# EAGLE schematic registerA (EAGLE 9.6.2)
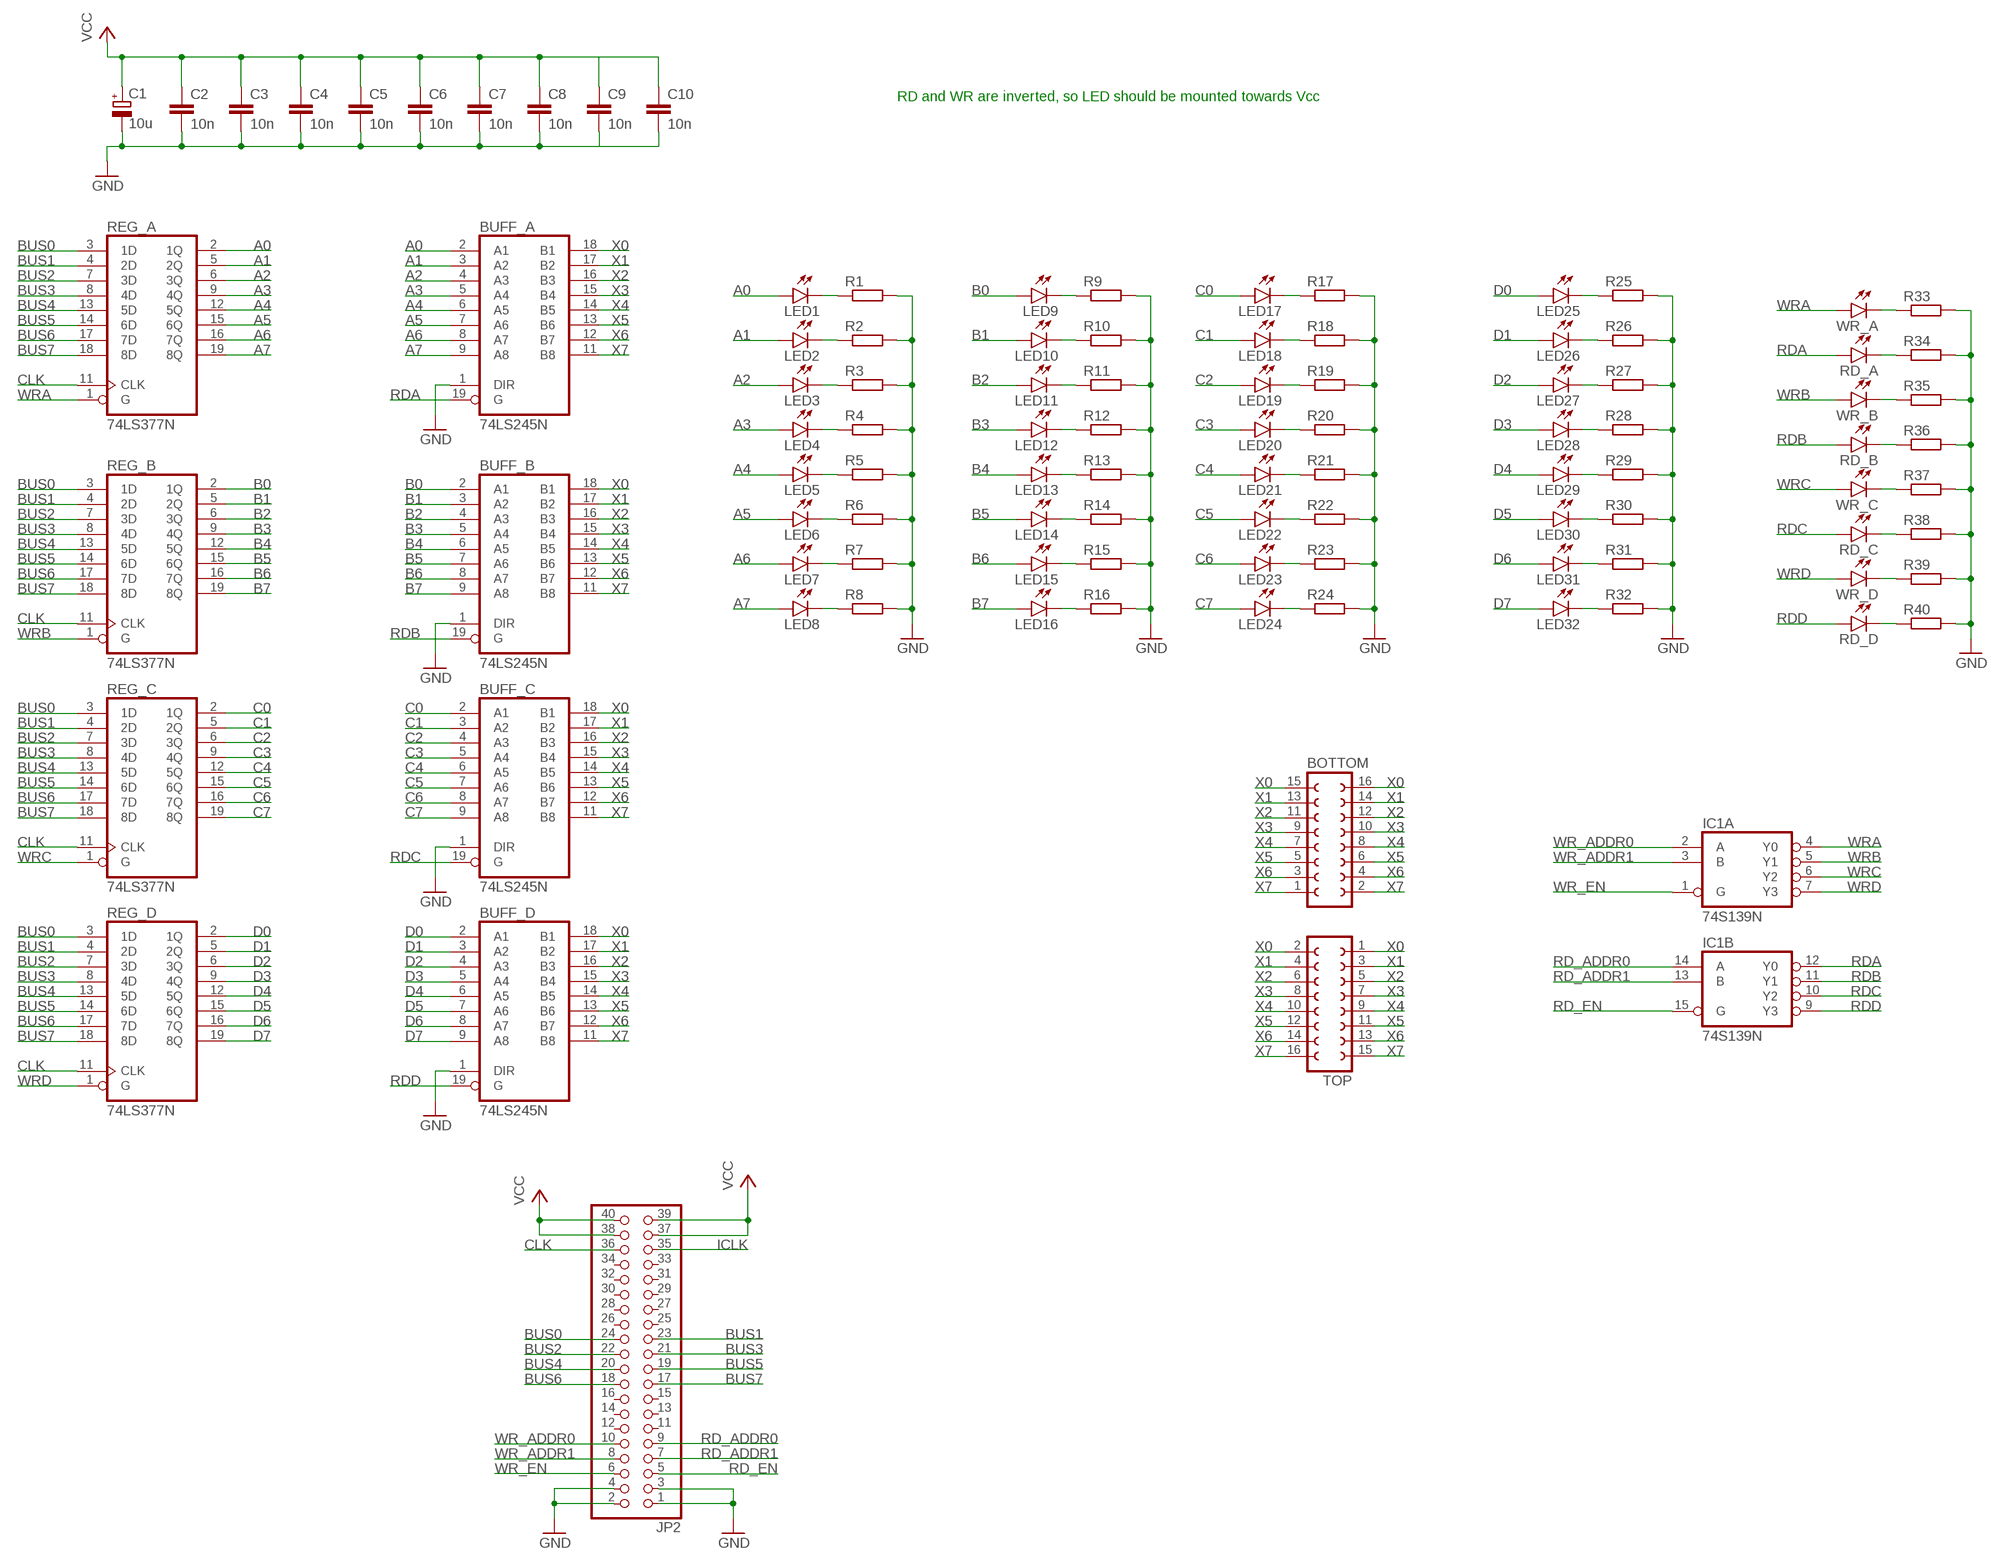
[diagram p0: schematic, sheet 1]

## Parts
BOTTOM  FE08-2W  [FE08-2W]
BUFF_A  74LS245N  [DIL20]
BUFF_B  74LS245N  [DIL20]
BUFF_C  74LS245N  [DIL20]
BUFF_D  74LS245N  [DIL20]
C1  10u  CPOL-EUE5-8.5  [E5-8,5]
C2  10n  C-EU025-024X044  [C025-024X044]
C3  10n  C-EU025-024X044  [C025-024X044]
C4  10n  C-EU025-024X044  [C025-024X044]
C5  10n  C-EU025-024X044  [C025-024X044]
C6  10n  C-EU025-024X044  [C025-024X044]
C7  10n  C-EU025-024X044  [C025-024X044]
C8  10n  C-EU025-024X044  [C025-024X044]
C9  10n  C-EU025-024X044  [C025-024X044]
C10  10n  C-EU025-024X044  [C025-024X044]
IC1  74S139N  [DIL16]
JP2  PINHD-2X20/90  [2X20/90]
LED1  LEDSML1206  [SML1206]
LED2  LEDSML1206  [SML1206]
LED3  LEDSML1206  [SML1206]
LED4  LEDSML1206  [SML1206]
LED5  LEDSML1206  [SML1206]
LED6  LEDSML1206  [SML1206]
LED7  LEDSML1206  [SML1206]
LED8  LEDSML1206  [SML1206]
LED9  LEDSML1206  [SML1206]
LED10  LEDSML1206  [SML1206]
LED11  LEDSML1206  [SML1206]
LED12  LEDSML1206  [SML1206]
LED13  LEDSML1206  [SML1206]
LED14  LEDSML1206  [SML1206]
LED15  LEDSML1206  [SML1206]
LED16  LEDSML1206  [SML1206]
LED17  LEDSML1206  [SML1206]
LED18  LEDSML1206  [SML1206]
LED19  LEDSML1206  [SML1206]
LED20  LEDSML1206  [SML1206]
LED21  LEDSML1206  [SML1206]
LED22  LEDSML1206  [SML1206]
LED23  LEDSML1206  [SML1206]
LED24  LEDSML1206  [SML1206]
LED25  LEDSML1206  [SML1206]
LED26  LEDSML1206  [SML1206]
LED27  LEDSML1206  [SML1206]
LED28  LEDSML1206  [SML1206]
LED29  LEDSML1206  [SML1206]
LED30  LEDSML1206  [SML1206]
LED31  LEDSML1206  [SML1206]
LED32  LEDSML1206  [SML1206]
R1  R-EU_R0805  [R0805]
R2  R-EU_R0805  [R0805]
R3  R-EU_R0805  [R0805]
R4  R-EU_R0805  [R0805]
R5  R-EU_R0805  [R0805]
R6  R-EU_R0805  [R0805]
R7  R-EU_R0805  [R0805]
R8  R-EU_R0805  [R0805]
R9  R-EU_R0805  [R0805]
R10  R-EU_R0805  [R0805]
R11  R-EU_R0805  [R0805]
R12  R-EU_R0805  [R0805]
R13  R-EU_R0805  [R0805]
R14  R-EU_R0805  [R0805]
R15  R-EU_R0805  [R0805]
R16  R-EU_R0805  [R0805]
R17  R-EU_R0805  [R0805]
R18  R-EU_R0805  [R0805]
R19  R-EU_R0805  [R0805]
R20  R-EU_R0805  [R0805]
R21  R-EU_R0805  [R0805]
R22  R-EU_R0805  [R0805]
R23  R-EU_R0805  [R0805]
R24  R-EU_R0805  [R0805]
R25  R-EU_R0805  [R0805]
R26  R-EU_R0805  [R0805]
R27  R-EU_R0805  [R0805]
R28  R-EU_R0805  [R0805]
R29  R-EU_R0805  [R0805]
R30  R-EU_R0805  [R0805]
R31  R-EU_R0805  [R0805]
R32  R-EU_R0805  [R0805]
R33  R-EU_R0805  [R0805]
R34  R-EU_R0805  [R0805]
R35  R-EU_R0805  [R0805]
R36  R-EU_R0805  [R0805]
R37  R-EU_R0805  [R0805]
R38  R-EU_R0805  [R0805]
R39  R-EU_R0805  [R0805]
R40  R-EU_R0805  [R0805]
RD_A  LEDSML1206  [SML1206]
RD_B  LEDSML1206  [SML1206]
RD_C  LEDSML1206  [SML1206]
RD_D  LEDSML1206  [SML1206]
REG_A  74LS377N  [DIL20]
REG_B  74LS377N  [DIL20]
REG_C  74LS377N  [DIL20]
REG_D  74LS377N  [DIL20]
TOP  FE08-2W  [FE08-2W]
WR_A  LEDSML1206  [SML1206]
WR_B  LEDSML1206  [SML1206]
WR_C  LEDSML1206  [SML1206]
WR_D  LEDSML1206  [SML1206]

## Nets
A0: BUFF_A.2(A1) LED1.A REG_A.2(1Q)
A1: BUFF_A.3(A2) LED2.A REG_A.5(2Q)
A2: BUFF_A.4(A3) LED3.A REG_A.6(3Q)
A3: BUFF_A.5(A4) LED4.A REG_A.9(4Q)
A4: BUFF_A.6(A5) LED5.A REG_A.12(5Q)
A5: BUFF_A.7(A6) LED6.A REG_A.15(6Q)
A6: BUFF_A.8(A7) LED7.A REG_A.16(7Q)
A7: BUFF_A.9(A8) LED8.A REG_A.19(8Q)
B0: BUFF_B.2(A1) LED9.A REG_B.2(1Q)
B1: BUFF_B.3(A2) LED10.A REG_B.5(2Q)
B2: BUFF_B.4(A3) LED11.A REG_B.6(3Q)
B3: BUFF_B.5(A4) LED12.A REG_B.9(4Q)
B4: BUFF_B.6(A5) LED13.A REG_B.12(5Q)
B5: BUFF_B.7(A6) LED14.A REG_B.15(6Q)
B6: BUFF_B.8(A7) LED15.A REG_B.16(7Q)
B7: BUFF_B.9(A8) LED16.A REG_B.19(8Q)
BUS0: JP2.24 REG_A.3(1D) REG_B.3(1D) REG_C.3(1D) REG_D.3(1D)
BUS1: JP2.23 REG_A.4(2D) REG_B.4(2D) REG_C.4(2D) REG_D.4(2D)
BUS2: JP2.22 REG_A.7(3D) REG_B.7(3D) REG_C.7(3D) REG_D.7(3D)
BUS3: JP2.21 REG_A.8(4D) REG_B.8(4D) REG_C.8(4D) REG_D.8(4D)
BUS4: JP2.20 REG_A.13(5D) REG_B.13(5D) REG_C.13(5D) REG_D.13(5D)
BUS5: JP2.19 REG_A.14(6D) REG_B.14(6D) REG_C.14(6D) REG_D.14(6D)
BUS6: JP2.18 REG_A.17(7D) REG_B.17(7D) REG_C.17(7D) REG_D.17(7D)
BUS7: JP2.17 REG_A.18(8D) REG_B.18(8D) REG_C.18(8D) REG_D.18(8D)
C0: BUFF_C.2(A1) LED17.A REG_C.2(1Q)
C1: BUFF_C.3(A2) LED18.A REG_C.5(2Q)
C2: BUFF_C.4(A3) LED19.A REG_C.6(3Q)
C3: BUFF_C.5(A4) LED20.A REG_C.9(4Q)
C4: BUFF_C.6(A5) LED21.A REG_C.12(5Q)
C5: BUFF_C.7(A6) LED22.A REG_C.15(6Q)
C6: BUFF_C.8(A7) LED23.A REG_C.16(7Q)
C7: BUFF_C.9(A8) LED24.A REG_C.19(8Q)
CLK: JP2.36 REG_A.11(CLK) REG_B.11(CLK) REG_C.11(CLK) REG_D.11(CLK)
D0: BUFF_D.2(A1) LED25.A REG_D.2(1Q)
D1: BUFF_D.3(A2) LED26.A REG_D.5(2Q)
D2: BUFF_D.4(A3) LED27.A REG_D.6(3Q)
D3: BUFF_D.5(A4) LED28.A REG_D.9(4Q)
D4: BUFF_D.6(A5) LED29.A REG_D.12(5Q)
D5: BUFF_D.7(A6) LED30.A REG_D.15(6Q)
D6: BUFF_D.8(A7) LED31.A REG_D.16(7Q)
D7: BUFF_D.9(A8) LED32.A REG_D.19(8Q)
GND: BUFF_A.1(DIR) BUFF_B.1(DIR) BUFF_C.1(DIR) BUFF_D.1(DIR) C1.- C2.2 C3.2 C4.2 C5.2 C6.2 C7.2 C8.2 C9.2 JP2.1 JP2.2 JP2.3 JP2.4 R1.2 R2.2 R3.2 R4.2 R5.2 R6.2 R7.2 R8.2 R9.2 R10.2 R11.2 R12.2 R13.2 R14.2 R15.2 R16.2 R17.2 R18.2 R19.2 R20.2 R21.2 R22.2 R23.2 R24.2 R25.2 R26.2 R27.2 R28.2 R29.2 R30.2 R31.2 R32.2 R33.2 R34.2 R35.2 R36.2 R37.2 R38.2 R39.2 R40.2
GND1: C10.2
ICLK: JP2.35
N$1: LED1.C R1.1
N$2: LED2.C R2.1
N$3: LED3.C R3.1
N$4: LED4.C R4.1
N$5: LED5.C R5.1
N$6: LED6.C R6.1
N$7: LED7.C R7.1
N$8: LED8.C R8.1
N$10: LED9.C R9.1
N$11: LED10.C R10.1
N$12: LED11.C R11.1
N$13: LED12.C R12.1
N$14: LED13.C R13.1
N$15: LED14.C R14.1
N$16: LED15.C R15.1
N$17: LED16.C R16.1
N$19: LED17.C R17.1
N$20: LED18.C R18.1
N$21: LED19.C R19.1
N$22: LED20.C R20.1
N$23: LED21.C R21.1
N$24: LED22.C R22.1
N$25: LED23.C R23.1
N$26: LED24.C R24.1
N$28: LED25.C R25.1
N$29: LED26.C R26.1
N$30: LED27.C R27.1
N$31: LED28.C R28.1
N$32: LED29.C R29.1
N$33: LED30.C R30.1
N$34: LED31.C R31.1
N$35: LED32.C R32.1
N$37: R33.1 WR_A.C
N$38: R34.1 RD_A.C
N$39: R35.1 WR_B.C
N$40: R36.1 RD_B.C
N$41: R37.1 WR_C.C
N$42: R38.1 RD_C.C
N$43: R39.1 WR_D.C
N$44: R40.1 RD_D.C
RD_ADDR0: IC1.14(B:A) JP2.9
RD_ADDR1: IC1.13(B:B) JP2.7
RD_EN: IC1.15(B:G) JP2.5
RDA: BUFF_A.19(G) IC1.12(B:Y0) RD_A.A
RDB: BUFF_B.19(G) IC1.11(B:Y1) RD_B.A
RDC: BUFF_C.19(G) IC1.10(B:Y2) RD_C.A
RDD: BUFF_D.19(G) IC1.9(B:Y3) RD_D.A
VCC: C1.+ C2.1 C3.1 C4.1 C5.1 C6.1 C7.1 C8.1 C9.1 JP2.37 JP2.38 JP2.39 JP2.40
VCC1: C10.1
WR_ADDR0: IC1.2(A:A) JP2.10
WR_ADDR1: IC1.3(A:B) JP2.8
WR_EN: IC1.1(A:G) JP2.6
WRA: IC1.4(A:Y0) REG_A.1(G) WR_A.A
WRB: IC1.5(A:Y1) REG_B.1(G) WR_B.A
WRC: IC1.6(A:Y2) REG_C.1(G) WR_C.A
WRD: IC1.7(A:Y3) REG_D.1(G) WR_D.A
X0: BOTTOM.15 BOTTOM.16 BUFF_A.18(B1) BUFF_B.18(B1) BUFF_C.18(B1) BUFF_D.18(B1) TOP.1 TOP.2
X1: BOTTOM.13 BOTTOM.14 BUFF_A.17(B2) BUFF_B.17(B2) BUFF_C.17(B2) BUFF_D.17(B2) TOP.3 TOP.4
X2: BOTTOM.11 BOTTOM.12 BUFF_A.16(B3) BUFF_B.16(B3) BUFF_C.16(B3) BUFF_D.16(B3) TOP.5 TOP.6
X3: BOTTOM.9 BOTTOM.10 BUFF_A.15(B4) BUFF_B.15(B4) BUFF_C.15(B4) BUFF_D.15(B4) TOP.7 TOP.8
X4: BOTTOM.7 BOTTOM.8 BUFF_A.14(B5) BUFF_B.14(B5) BUFF_C.14(B5) BUFF_D.14(B5) TOP.9 TOP.10
X5: BOTTOM.5 BOTTOM.6 BUFF_A.13(B6) BUFF_B.13(B6) BUFF_C.13(B6) BUFF_D.13(B6) TOP.11 TOP.12
X6: BOTTOM.3 BOTTOM.4 BUFF_A.12(B7) BUFF_B.12(B7) BUFF_C.12(B7) BUFF_D.12(B7) TOP.13 TOP.14
X7: BOTTOM.1 BOTTOM.2 BUFF_A.11(B8) BUFF_B.11(B8) BUFF_C.11(B8) BUFF_D.11(B8) TOP.15 TOP.16
Unconnected: JP2.11 JP2.12 JP2.13 JP2.14 JP2.15 JP2.16 JP2.25 JP2.26 JP2.27 JP2.28 JP2.29 JP2.30 JP2.31 JP2.32 JP2.33 JP2.34

## Notes on the sheet
- RD and WR are inverted, so LED should be mounted towards Vcc

## Power pins joined to a net without a drawn wire
GND: BUFF_A.10(GND) BUFF_B.10(GND) BUFF_C.10(GND) BUFF_D.10(GND) IC1.8(P:GND) REG_A.10(GND) REG_B.10(GND) REG_C.10(GND) REG_D.10(GND)
VCC: BUFF_A.20(VCC) BUFF_B.20(VCC) BUFF_C.20(VCC) BUFF_D.20(VCC) IC1.16(P:VCC) REG_A.20(VCC) REG_B.20(VCC) REG_C.20(VCC) REG_D.20(VCC)

## Library data of the parts
BOTTOM TOP = con-lsta:FE08-2W: FEMALE HEADER; OC_FARNELL: unknown; OC_NEWARK: unknown
BUFF_A BUFF_B BUFF_C BUFF_D = 74xx-eu:74*245: Octal BUS TRANSCEIVER, 3-state
C1 = rcl:CPOL-EU: POLARIZED CAPACITOR, European symbol; SPICEPREFIX: C
C2-C10 = rcl:C-EU: CAPACITOR, European symbol; SPICEPREFIX: C
IC1 = 74xx-eu:74*139: Dual 2-line to 4-line DECODER/DEMULTIPLEXER
JP2 = pinhead:PINHD-2X20: PIN HEADER
LED1-LED32 RD_A RD_B RD_C RD_D WR_A WR_B WR_C WR_D = led:LED: LED OSRAM: - CHIPLED LG R971, LG N971, LY N971, LG Q971, LY Q971, LO R971, LY R971 LH N974, LH R974 LS Q976, LO Q976, LY Q976 LO Q996 - Hyper CHIPLED LW Q18S LB Q993, LB Q99A, LB R99A - SideLED LS A670, LO A670, LY A670, LG A670, LP A670 LB A673, LV A673, LT A673, LW A673 LH A674 LY A675 LS A676, LA A676, LO A676, LY A676, LW A676 LS A679, LY A679, LG A679 - Hyper Micro SIDELED® LS Y876, LA Y876, LO Y876, LY Y876 LT Y87S - SmartLED LW L88C, LW L88S LB L89C, LB L89S, LG L890 LS L89K, LO L89K, LY L89K LS L896, LA L896, LO L896, LY L896 - TOPLED LS T670, LO T670, LY T670, LG T670, LP T670 LSG T670, LSP T670, LSY T670, LOP T670, LYG T670 LG T671, LOG T671, LSG T671 LB T673, LV T673, LT T673, LW T673 LH T674 LS T676, LA T676, LO T676, LY T676, LB T676, LH T676, LSB T676, LW T676 LB T67C, LV T67C, LT T67C, LS T67K, LO T67K, LY T67K, LW E67C LS E67B, LA E67B, LO E67B, LY E67B, LB E67C, LV E67C, LT E67C LW T67C LS T679, LY T679, LG T679 LS T770, LO T770, LY T770, LG T770, LP T770 LB T773, LV T773, LT T773, LW T773 LH T774 LS E675, LA E675, LY E675, LS T675 LS T776, LA T776, LO T776, LY T776, LB T776 LHGB T686 LT T68C, LB T68C - Hyper Mini TOPLED® LB M676 - Mini TOPLED Santana® LG M470 LS M47K, LO M47K, LY M47K Source: http://www.osram.convergy.de LUXEON: - LUMILED® LXK2-PW12-R00, LXK2-PW12-S00, LXK2-PW14-U00, LXK2-PW14-V00 LXK2-PM12-R00, LXK2-PM12-S00, LXK2-PM14-U00 LXK2-PE12-Q00, LXK2-PE12-R00, LXK2-PE12-S00, LXK2-PE14-T00, LXK2-PE14-U00 LXK2-PB12-K00, LXK2-PB12-L00, LXK2-PB12-M00, LXK2-PB14-N00, LXK2-PB14-P00, LXK2-PB14-Q00 LXK2-PR12-L00, LXK2-PR12-M00, LXK2-PR14-Q00, LXK2-PR14-R00 LXK2-PD12-Q00, LXK2-PD12-R00, LXK2-PD12-S00 LXK2-PH12-R00, LXK2-PH12-S00 LXK2-PL12-P00, LXK2-PL12-Q00, LXK2-PL12-R00 Source: www.luxeon.com KINGBRIGHT: KA-3528ASYC Source: www.kingbright.com
R1-R40 = rcl:R-EU_: RESISTOR, European symbol; SPICEPREFIX: R
REG_A REG_B REG_C REG_D = 74xx-eu:74*377: Octal D type FLIP FLOP, enable